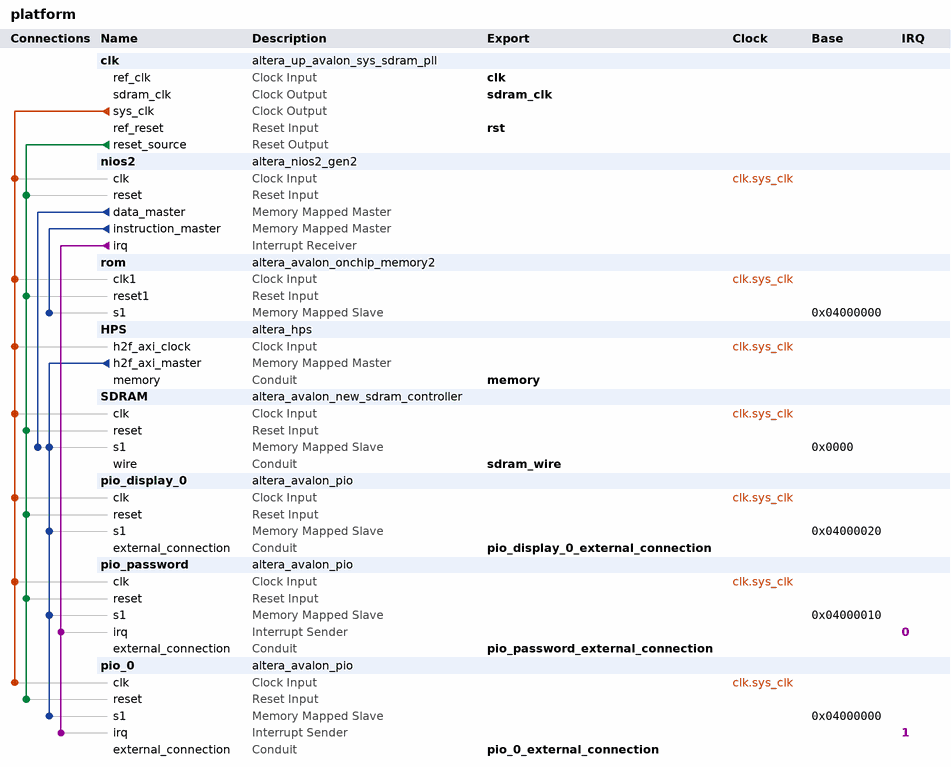
[diagram p0: system contents]
# Platform Designer (Qsys) system platform, Cyclone V 5CSEMA5F31C6
# Parameters at their usual value, and those the tool derives, are not listed.
package require -exact qsys 20.1
create_system platform
set_project_property DEVICE_FAMILY {Cyclone V}
set_project_property DEVICE 5CSEMA5F31C6

add_instance clk altera_up_avalon_sys_sdram_pll 18.0
set_instance_parameter_value clk CV_boards DE10-Standard
set_instance_parameter_value clk gui_outclk 50.0
set_instance_parameter_value clk gui_refclk 50.0

add_instance nios2 altera_nios2_gen2 20.1
set_instance_parameter_value nios2 dcache_size 2048
set_instance_parameter_value nios2 debug_enabled false
set_instance_parameter_value nios2 exceptionSlave rom.s1
set_instance_parameter_value nios2 icache_size 4096
set_instance_parameter_value nios2 impl Tiny
set_instance_parameter_value nios2 resetSlave rom.s1

add_instance rom altera_avalon_onchip_memory2 20.1
set_instance_parameter_value rom dataWidth 32
set_instance_parameter_value rom dualPort false
set_instance_parameter_value rom initMemContent true
set_instance_parameter_value rom initializationFileName onchip_mem.hex
set_instance_parameter_value rom memorySize 16384
set_instance_parameter_value rom writable false

add_instance HPS altera_hps 20.1
set_instance_parameter_value HPS EMAC1_Mode N/A
set_instance_parameter_value HPS EMAC1_PinMuxing Unused
set_instance_parameter_value HPS F2SCLK_COLDRST_Enable false
set_instance_parameter_value HPS F2SCLK_DBGRST_Enable false
set_instance_parameter_value HPS F2SCLK_WARMRST_Enable false
set_instance_parameter_value HPS F2SINTERRUPT_Enable false
set_instance_parameter_value HPS F2S_Width 0
set_instance_parameter_value HPS FPGA_PERIPHERAL_OUTPUT_CLOCK_FREQ_EMAC0_GTX_CLK 125
set_instance_parameter_value HPS FPGA_PERIPHERAL_OUTPUT_CLOCK_FREQ_EMAC0_MD_CLK 2.5
set_instance_parameter_value HPS FPGA_PERIPHERAL_OUTPUT_CLOCK_FREQ_EMAC1_GTX_CLK 125
set_instance_parameter_value HPS FPGA_PERIPHERAL_OUTPUT_CLOCK_FREQ_EMAC1_MD_CLK 2.5
set_instance_parameter_value HPS HPS_PROTOCOL DDR3
set_instance_parameter_value HPS I2C0_Mode N/A
set_instance_parameter_value HPS I2C0_PinMuxing Unused
set_instance_parameter_value HPS I2C1_Mode N/A
set_instance_parameter_value HPS I2C1_PinMuxing Unused
set_instance_parameter_value HPS LWH2F_Enable false
set_instance_parameter_value HPS MEM_BANKADDR_WIDTH 3
set_instance_parameter_value HPS MEM_CLK_FREQ 300.0
set_instance_parameter_value HPS MEM_CLK_FREQ_MAX 400.0
set_instance_parameter_value HPS MEM_COL_ADDR_WIDTH 8
set_instance_parameter_value HPS MEM_DQ_WIDTH 8
set_instance_parameter_value HPS MEM_DRV_STR RZQ/6
set_instance_parameter_value HPS MEM_ROW_ADDR_WIDTH 12
set_instance_parameter_value HPS MEM_RTT_NOM {ODT Disabled}
set_instance_parameter_value HPS MEM_RTT_WR {Dynamic ODT off}
set_instance_parameter_value HPS MEM_TCL 7
set_instance_parameter_value HPS MEM_TFAW_NS 37.5
set_instance_parameter_value HPS MEM_TINIT_US 499
set_instance_parameter_value HPS MEM_TMRD_CK 3
set_instance_parameter_value HPS MEM_TRAS_NS 40.0
set_instance_parameter_value HPS MEM_TRCD_NS 15.0
set_instance_parameter_value HPS MEM_TREFI_US 7.0
set_instance_parameter_value HPS MEM_TRFC_NS 75.0
set_instance_parameter_value HPS MEM_TRP_NS 15.0
set_instance_parameter_value HPS MEM_TWTR 2
set_instance_parameter_value HPS MEM_VENDOR JEDEC
set_instance_parameter_value HPS MEM_WTCL 6
set_instance_parameter_value HPS QSPI_Mode N/A
set_instance_parameter_value HPS QSPI_PinMuxing Unused
set_instance_parameter_value HPS REF_CLK_FREQ 125.0
set_instance_parameter_value HPS S2FCLK_USER2CLK 5
set_instance_parameter_value HPS S2F_Width 2
set_instance_parameter_value HPS SDIO_Mode N/A
set_instance_parameter_value HPS SDIO_PinMuxing Unused
set_instance_parameter_value HPS SPIM1_Mode N/A
set_instance_parameter_value HPS SPIM1_PinMuxing Unused
set_instance_parameter_value HPS STM_Enable false
set_instance_parameter_value HPS TIMING_BOARD_AC_SKEW 0.02
set_instance_parameter_value HPS TIMING_BOARD_AC_TO_CK_SKEW 0.0
set_instance_parameter_value HPS TIMING_BOARD_DQ_TO_DQS_SKEW 0.0
set_instance_parameter_value HPS TIMING_BOARD_MAX_CK_DELAY 0.6
set_instance_parameter_value HPS TIMING_BOARD_MAX_DQS_DELAY 0.6
set_instance_parameter_value HPS TIMING_BOARD_SKEW_BETWEEN_DQS 0.02
set_instance_parameter_value HPS TIMING_BOARD_SKEW_CKDQS_DIMM_MAX 0.01
set_instance_parameter_value HPS TIMING_BOARD_SKEW_CKDQS_DIMM_MIN -0.01
set_instance_parameter_value HPS TIMING_BOARD_SKEW_WITHIN_DQS 0.02
set_instance_parameter_value HPS TIMING_TDH 125
set_instance_parameter_value HPS TIMING_TDQSCK 400
set_instance_parameter_value HPS TIMING_TDQSQ 120
set_instance_parameter_value HPS TIMING_TDS 50
set_instance_parameter_value HPS TIMING_TIH 250
set_instance_parameter_value HPS TIMING_TIS 175
set_instance_parameter_value HPS TIMING_TQSH 0.38
set_instance_parameter_value HPS UART0_Mode N/A
set_instance_parameter_value HPS UART0_PinMuxing Unused
set_instance_parameter_value HPS USB1_Mode N/A
set_instance_parameter_value HPS USB1_PinMuxing Unused
set_instance_parameter_value HPS desired_cfg_clk_mhz 100.0
set_instance_parameter_value HPS desired_qspi_clk_mhz 400.0

add_instance SDRAM altera_avalon_new_sdram_controller 20.1
set_instance_parameter_value SDRAM TAC 5.4
set_instance_parameter_value SDRAM TRCD 15.0
set_instance_parameter_value SDRAM TRP 15.0
set_instance_parameter_value SDRAM casLatency 3
set_instance_parameter_value SDRAM columnWidth 8
set_instance_parameter_value SDRAM dataWidth 64
set_instance_parameter_value SDRAM generateSimulationModel false
set_instance_parameter_value SDRAM model single_Micron_MT48LC4M32B2_7_chip
set_instance_parameter_value SDRAM numberOfBanks 2
set_instance_parameter_value SDRAM numberOfChipSelects 4
set_instance_parameter_value SDRAM powerUpDelay 100.0
set_instance_parameter_value SDRAM refreshPeriod 7.8125
set_instance_parameter_value SDRAM rowWidth 12

add_instance pio_display_0 altera_avalon_pio 20.1
set_instance_parameter_value pio_display_0 direction Output
set_instance_parameter_value pio_display_0 width 7

add_instance pio_password altera_avalon_pio 20.1
set_instance_parameter_value pio_password direction Input
set_instance_parameter_value pio_password generateIRQ true
set_instance_parameter_value pio_password width 4

add_instance pio_0 altera_avalon_pio 20.1
set_instance_parameter_value pio_0 direction Input
set_instance_parameter_value pio_0 generateIRQ true
set_instance_parameter_value pio_0 width 1

# connections
add_connection clk.sys_clk HPS.h2f_axi_clock clock
add_connection clk.sys_clk nios2.clk clock
add_connection clk.sys_clk pio_0.clk clock
add_connection clk.sys_clk pio_display_0.clk clock
add_connection clk.sys_clk pio_password.clk clock
add_connection clk.sys_clk rom.clk1 clock
add_connection clk.sys_clk SDRAM.clk clock
add_connection clk.reset_source nios2.reset reset
add_connection clk.reset_source pio_0.reset reset
add_connection clk.reset_source pio_display_0.reset reset
add_connection clk.reset_source pio_password.reset reset
add_connection clk.reset_source rom.reset1 reset
add_connection clk.reset_source SDRAM.reset reset
add_connection HPS.h2f_axi_master pio_0.s1 avalon
set_connection_parameter_value HPS.h2f_axi_master/pio_0.s1 baseAddress 0x04000000
add_connection HPS.h2f_axi_master pio_display_0.s1 avalon
set_connection_parameter_value HPS.h2f_axi_master/pio_display_0.s1 baseAddress 0x04000020
add_connection HPS.h2f_axi_master pio_password.s1 avalon
set_connection_parameter_value HPS.h2f_axi_master/pio_password.s1 baseAddress 0x04000010
add_connection HPS.h2f_axi_master SDRAM.s1 avalon
set_connection_parameter_value HPS.h2f_axi_master/SDRAM.s1 baseAddress 0x0000
add_connection nios2.data_master SDRAM.s1 avalon
set_connection_parameter_value nios2.data_master/SDRAM.s1 baseAddress 0x0000
add_connection nios2.instruction_master rom.s1 avalon
set_connection_parameter_value nios2.instruction_master/rom.s1 baseAddress 0x04000000
add_connection nios2.irq pio_0.irq interrupt
set_connection_parameter_value nios2.irq/pio_0.irq irqNumber 1
add_connection nios2.irq pio_password.irq interrupt
set_connection_parameter_value nios2.irq/pio_password.irq irqNumber 0

# exported interfaces
add_interface clk clock sink
set_interface_property clk EXPORT_OF clk.ref_clk
add_interface memory conduit end
set_interface_property memory EXPORT_OF HPS.memory
add_interface pio_0_external_connection conduit end
set_interface_property pio_0_external_connection EXPORT_OF pio_0.external_connection
add_interface pio_display_0_external_connection conduit end
set_interface_property pio_display_0_external_connection EXPORT_OF pio_display_0.external_connection
add_interface pio_password_external_connection conduit end
set_interface_property pio_password_external_connection EXPORT_OF pio_password.external_connection
add_interface rst reset sink
set_interface_property rst EXPORT_OF clk.ref_reset
add_interface sdram_clk clock source
set_interface_property sdram_clk EXPORT_OF clk.sdram_clk
add_interface sdram_wire conduit end
set_interface_property sdram_wire EXPORT_OF SDRAM.wire

set_interconnect_requirement {$system} qsys_mm.clockCrossingAdapter HANDSHAKE
set_interconnect_requirement {$system} qsys_mm.enableEccProtection FALSE
set_interconnect_requirement {$system} qsys_mm.insertDefaultSlave FALSE
set_interconnect_requirement {$system} qsys_mm.maxAdditionalLatency 1

save_system platform.qsys
